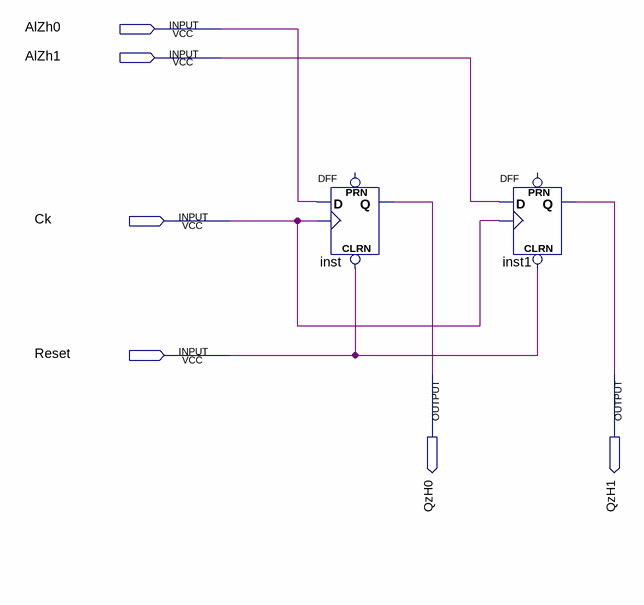
[diagram p0: schematic sheet]
// Quartus schematic Reg2bits.bdf as structural Verilog: 2 symbols, 6 pins
module Reg2bits (
  input  AlZh0,
  input  AlZh1,
  input  Ck,
  input  Reset,
  output QzH0,
  output QzH1
);

  DFF inst (.CLRN(Reset), .CLK(Ck), .D(AlZh0), .Q(QzH0));  // open: PRN
  DFF inst1 (.CLRN(Reset), .CLK(Ck), .D(AlZh1), .Q(QzH1));  // open: PRN
endmodule
